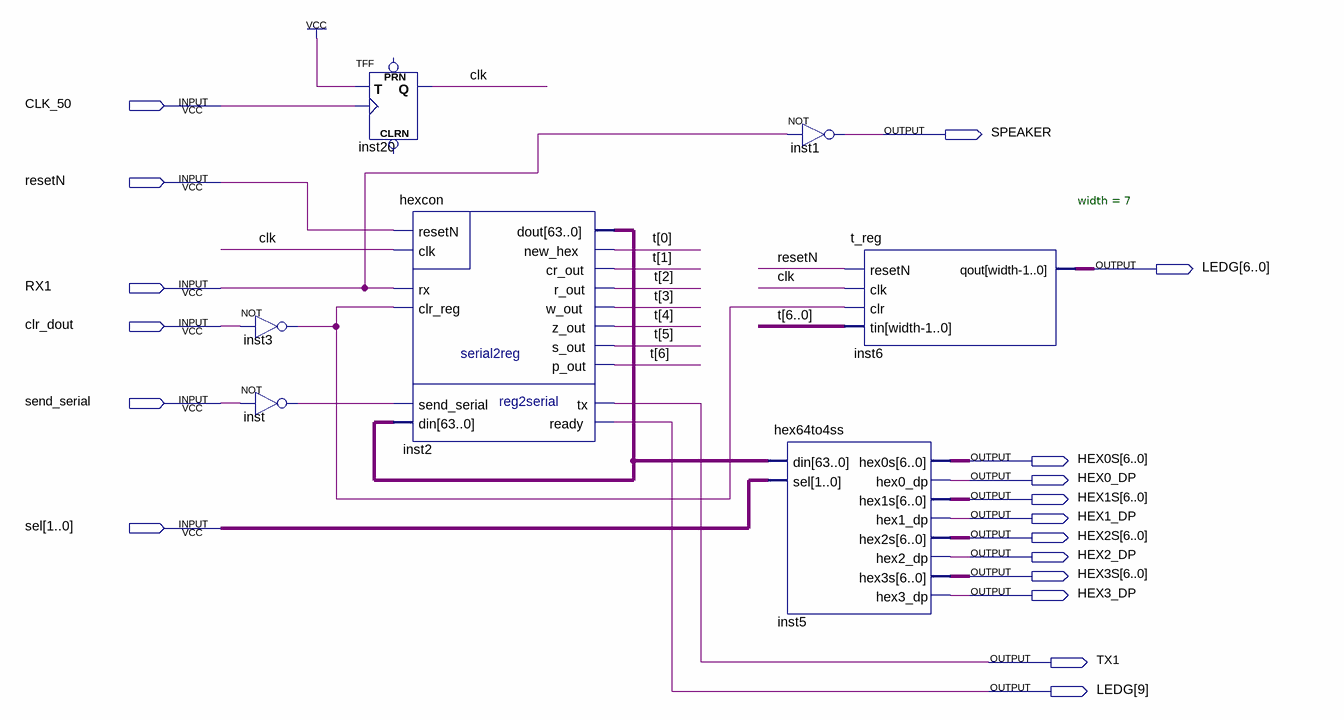
[diagram p0: schematic sheet]
// Quartus schematic test_hexcon.bdf as structural Verilog: 7 symbols, 18 pins
module test_hexcon (
  input  CLK_50,
  input  resetN,
  input  RX1,
  input  clr_dout,
  input  send_serial,
  input  [1:0] sel,
  output SPEAKER,
  output [9:0] LEDG,
  output [6:0] HEX0S,
  output HEX0_DP,
  output [6:0] HEX1S,
  output HEX1_DP,
  output [6:0] HEX2S,
  output HEX2_DP,
  output [6:0] HEX3S,
  output HEX3_DP,
  output TX1
);

  wire clk, inst3_out, inst_out;
  wire [6:0] t;
  wire [63:0] inst2_dout;

  not inst3 (inst3_out, clr_dout);
  not inst (inst_out, send_serial);
  TFF inst20 (.T(1'b1), .CLK(CLK_50), .Q(clk));  // open: PRN, CLRN
  hexcon inst2 (
    .resetN(resetN), .clk(clk), .rx(RX1), .clr_reg(inst3_out), .send_serial(inst_out), .din(inst2_dout),
    .tx(TX1), .dout(inst2_dout), .new_hex(t[0]), .cr_out(t[1]), .r_out(t[2]), .w_out(t[3]), .z_out(t[4]),
    .s_out(t[5]), .p_out(t[6]), .ready(LEDG[9]));
  not inst1 (SPEAKER, RX1);
  hex64to4ss inst5 (
    .din(inst2_dout), .sel(sel), .hex0s(HEX0S), .hex0_dp(HEX0_DP), .hex1s(HEX1S), .hex1_dp(HEX1_DP),
    .hex2s(HEX2S), .hex2_dp(HEX2_DP), .hex3s(HEX3S), .hex3_dp(HEX3_DP));
  t_reg #(.width(7)) inst6 (.resetN(resetN), .clk(clk), .clr(inst3_out), .tin(t), .qout(LEDG[6:0]));
endmodule
